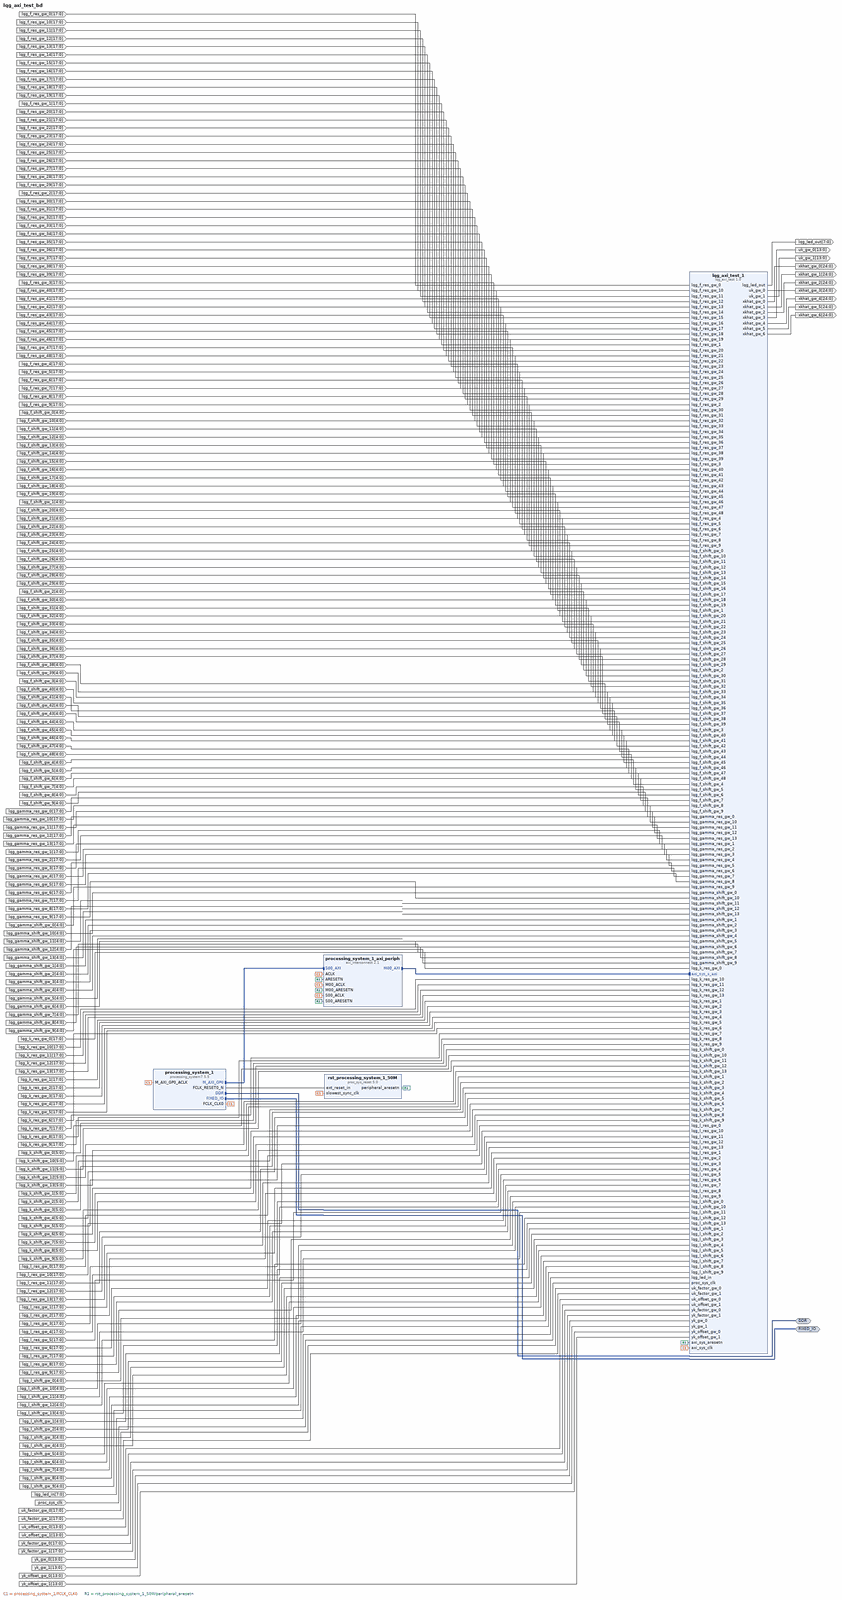
[diagram p0: block diagram of the top level, whole]
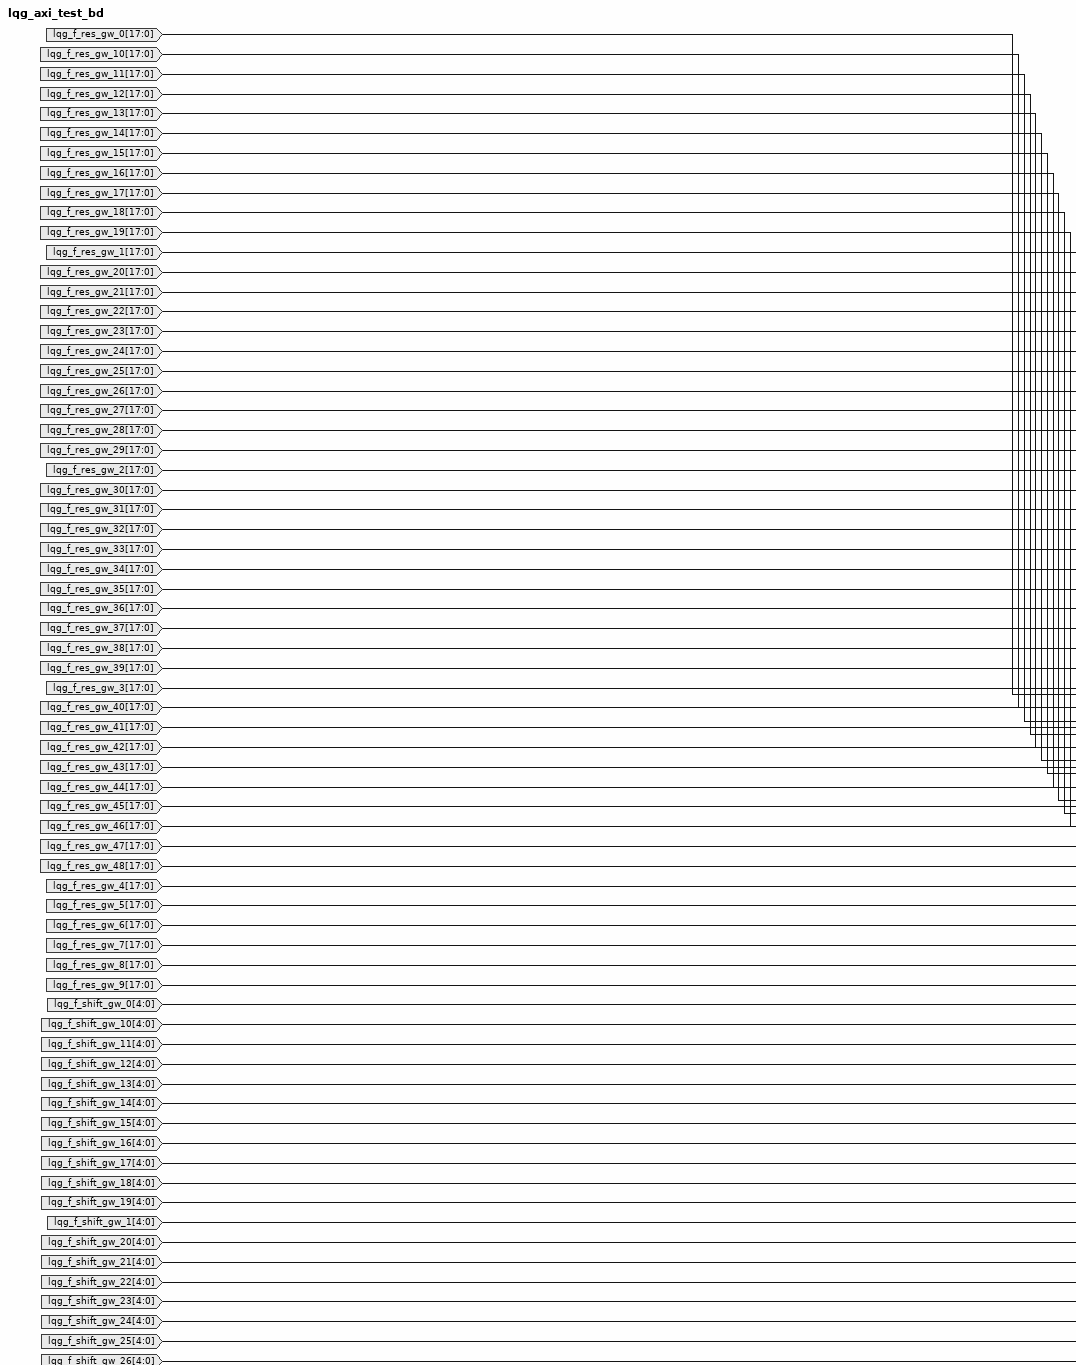
[diagram p1: block diagram of the top level, upper left part]
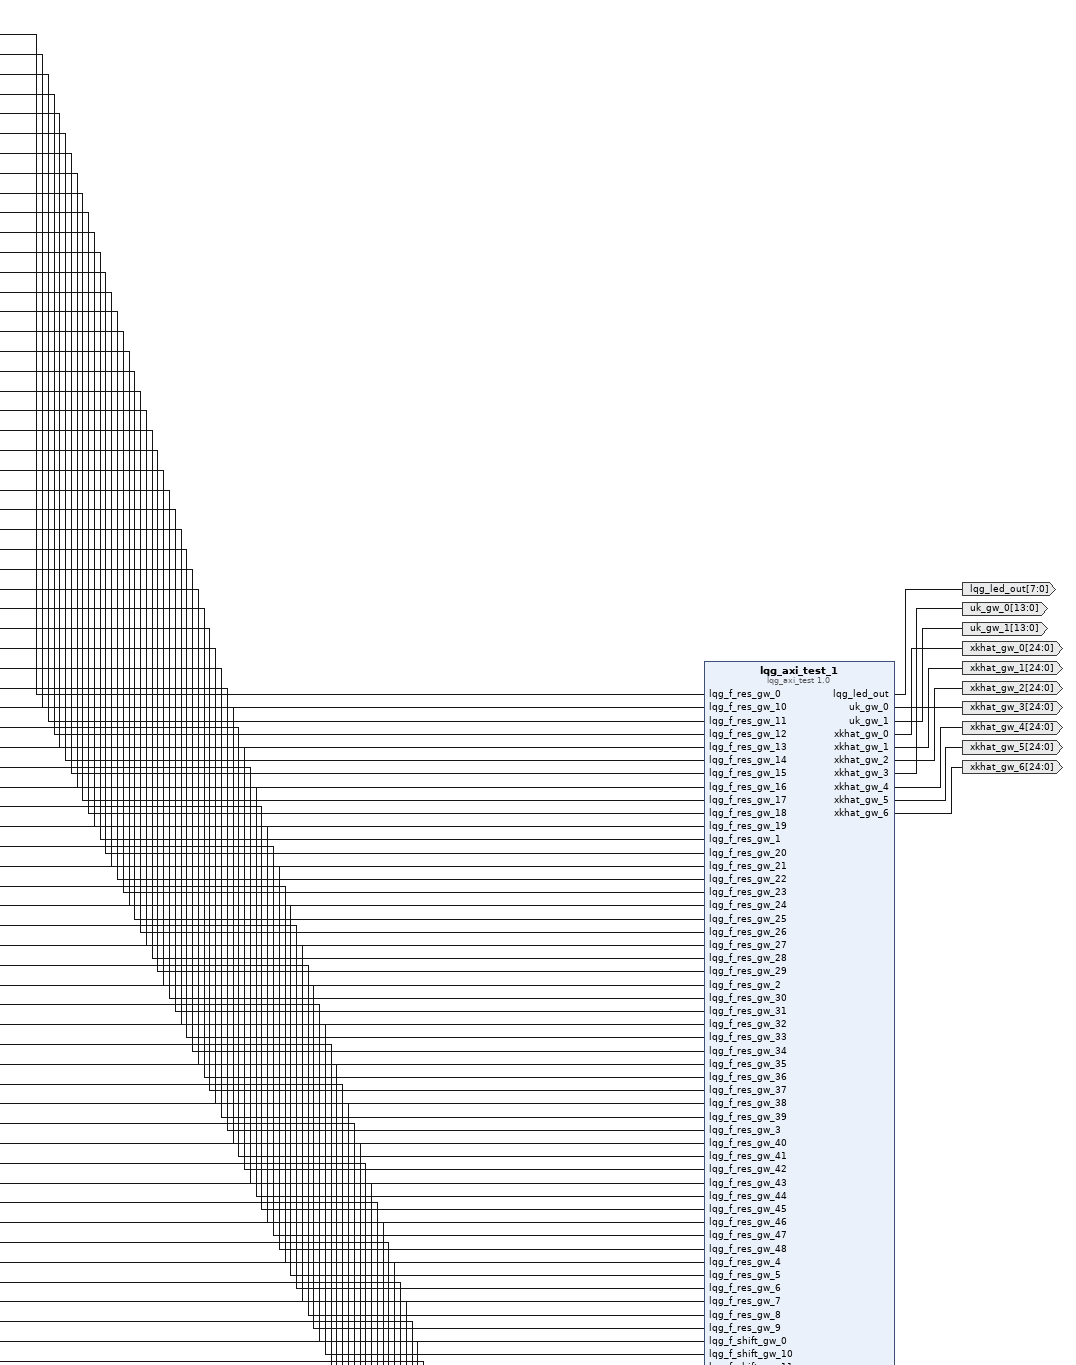
[diagram p2: block diagram of the top level, upper right part]
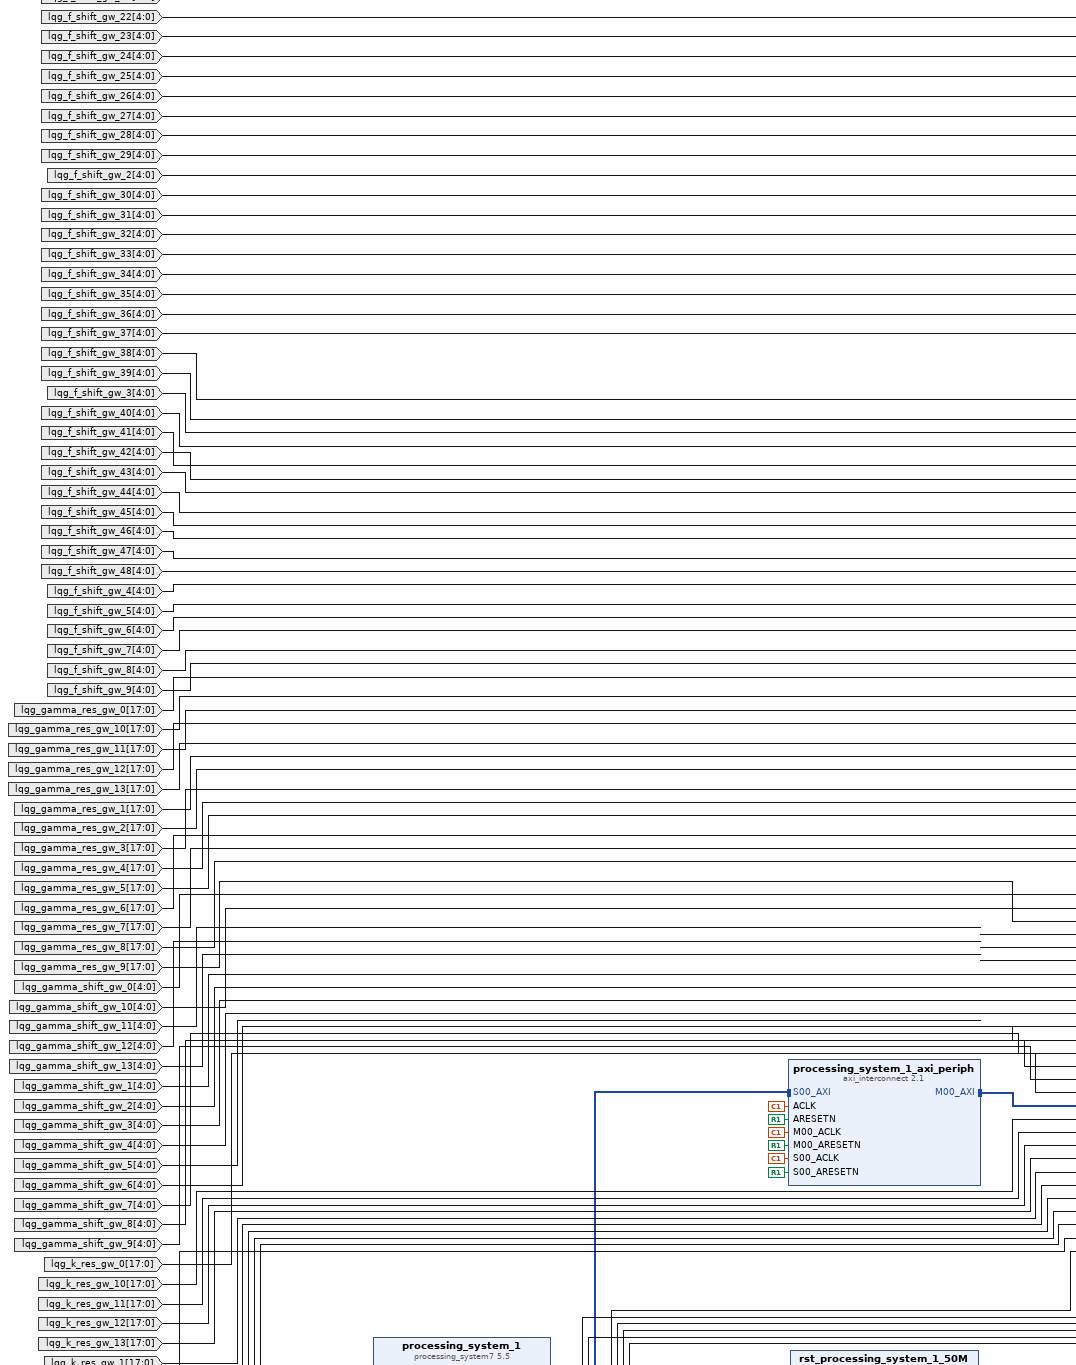
[diagram p3: block diagram of the top level, middle left part]
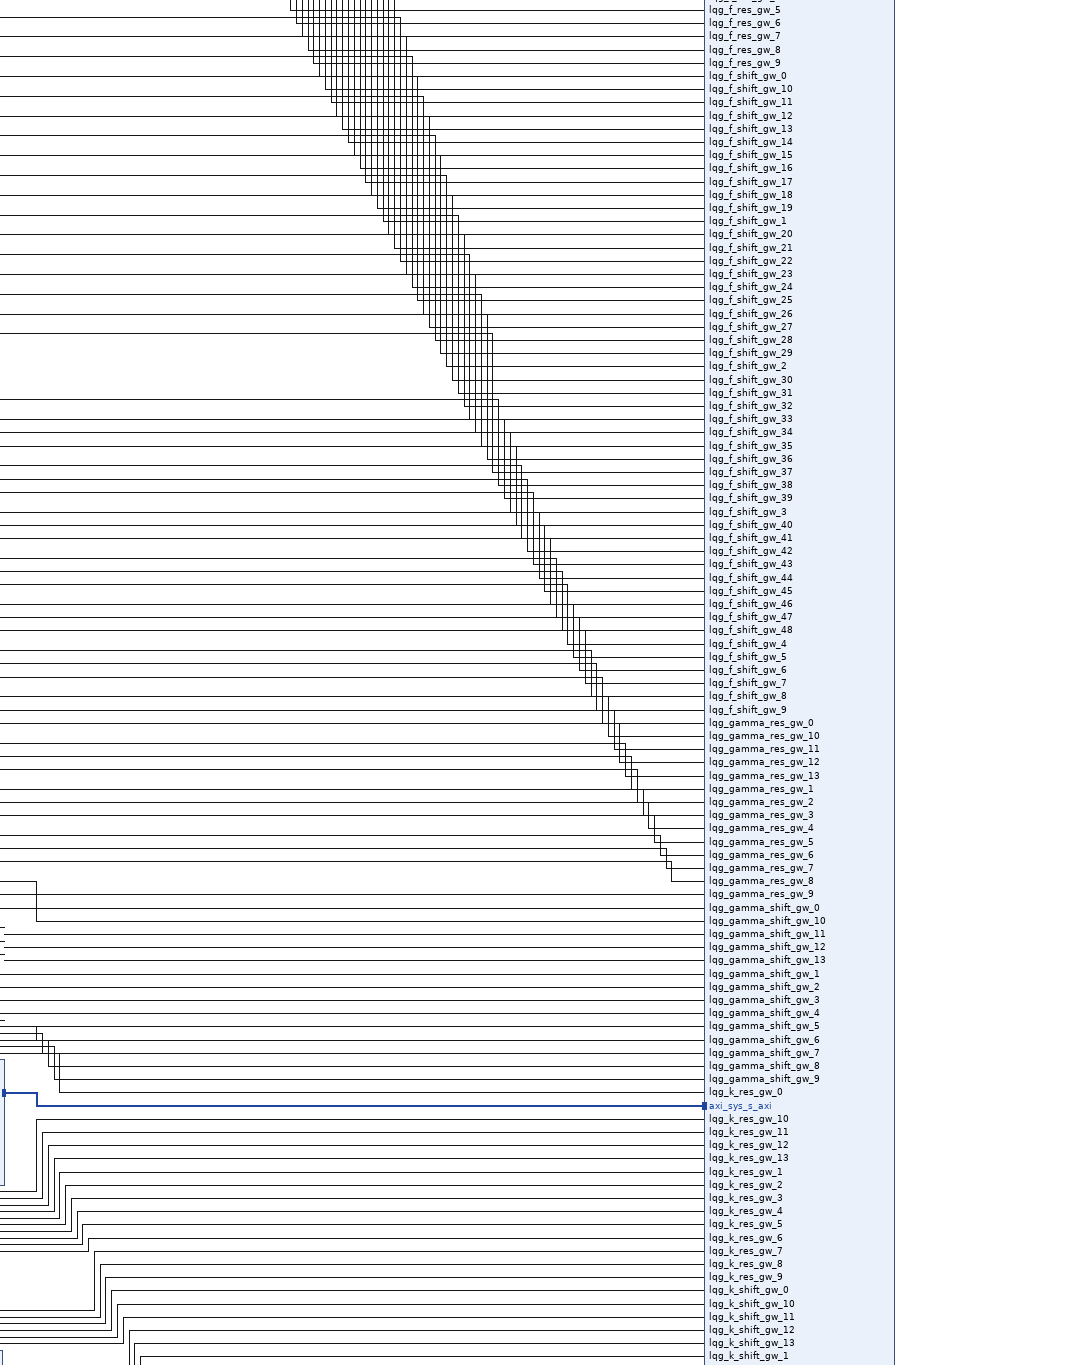
[diagram p4: block diagram of the top level, middle right part]
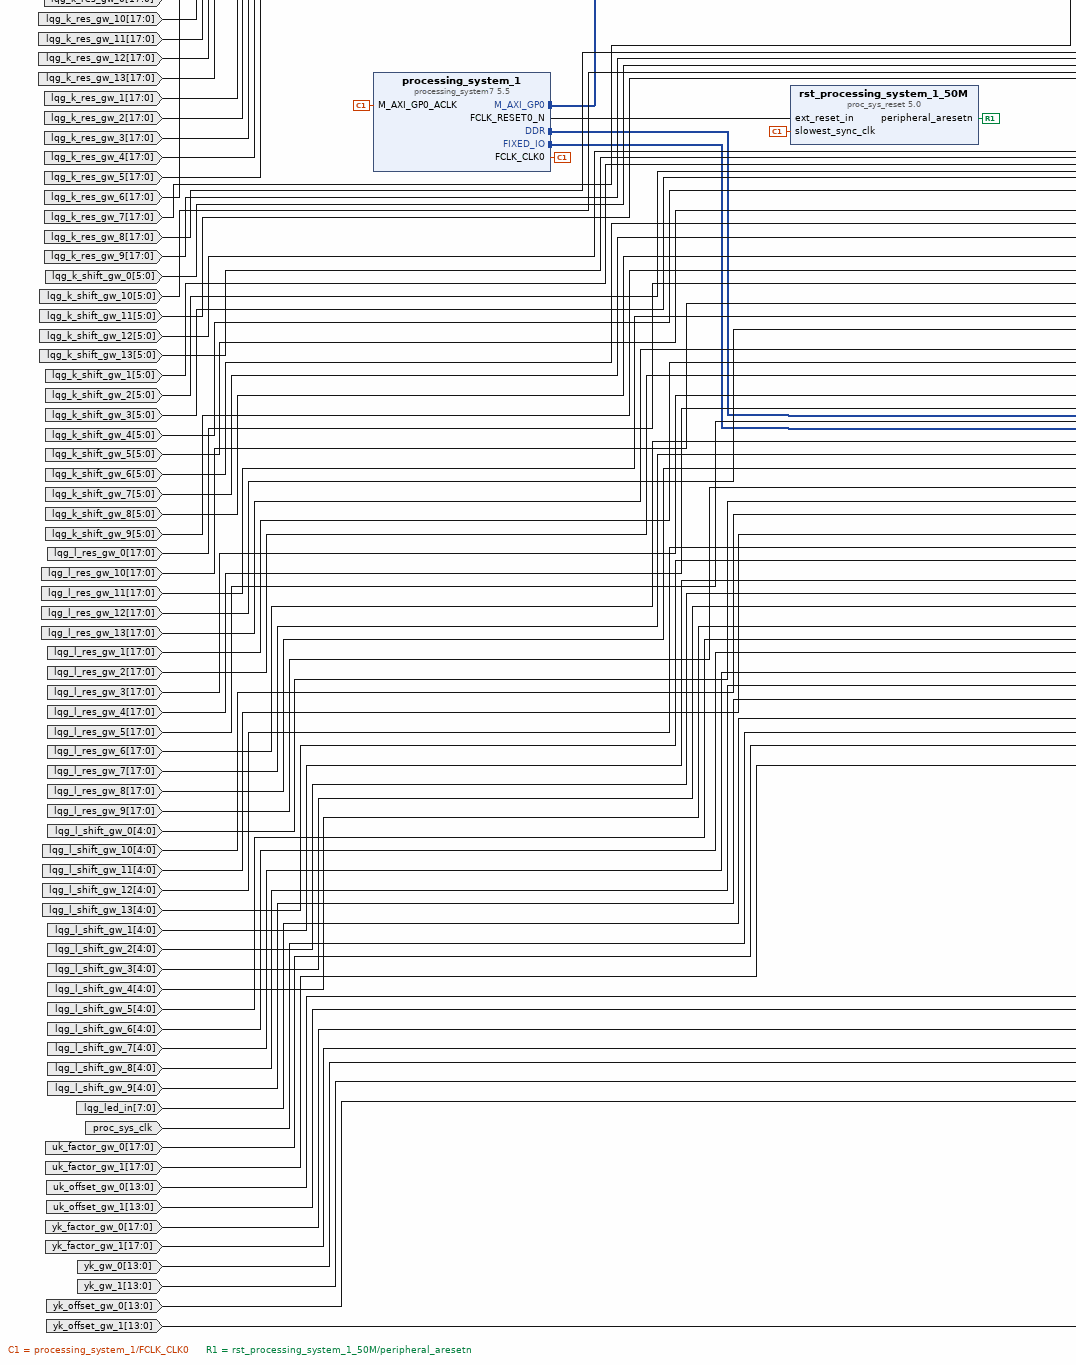
[diagram p5: block diagram of the top level, lower left part]
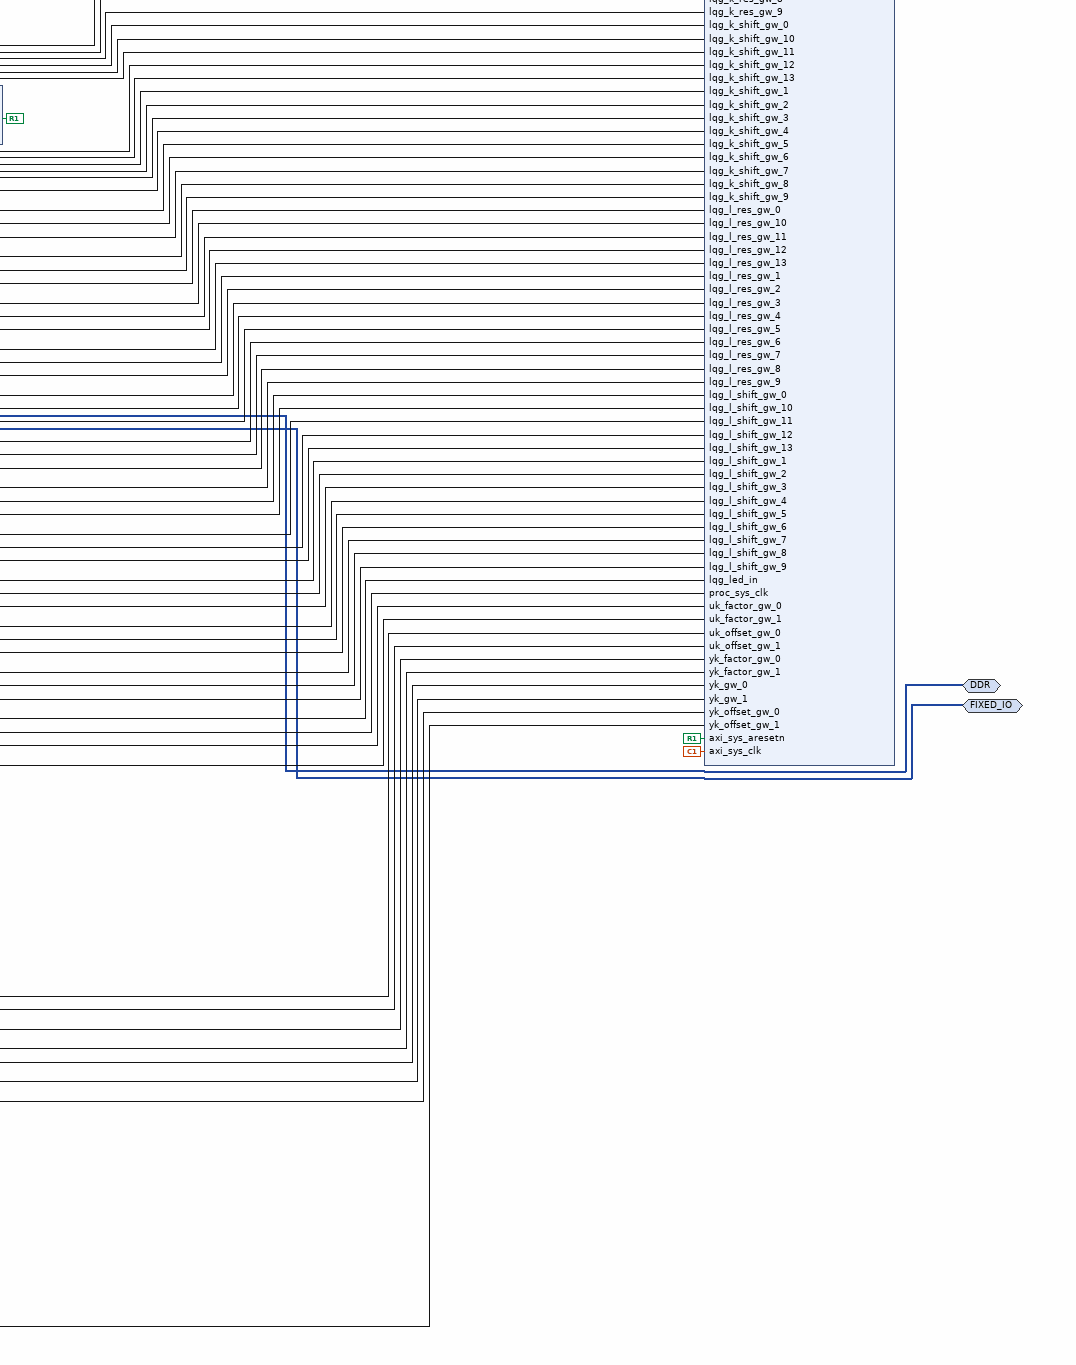
[diagram p6: block diagram of the top level, lower right part]
# Vivado block design lqg_axi_test_bd, xc7z020clg400-2, Vivado 2024.2
create_bd_design lqg_axi_test_bd

create_bd_intf_port -mode Master -vlnv xilinx.com:interface:ddrx_rtl:1.0 DDR
create_bd_intf_port -mode Master -vlnv xilinx.com:display_processing_system7:fixedio_rtl:1.0 FIXED_IO
create_bd_port -dir I -from 17 -to 0 -type data lqg_f_res_gw_0
create_bd_port -dir I -from 17 -to 0 -type data lqg_f_res_gw_1
create_bd_port -dir I -from 17 -to 0 -type data lqg_f_res_gw_10
create_bd_port -dir I -from 17 -to 0 -type data lqg_f_res_gw_11
create_bd_port -dir I -from 17 -to 0 -type data lqg_f_res_gw_12
create_bd_port -dir I -from 17 -to 0 -type data lqg_f_res_gw_13
create_bd_port -dir I -from 17 -to 0 -type data lqg_f_res_gw_14
create_bd_port -dir I -from 17 -to 0 -type data lqg_f_res_gw_15
create_bd_port -dir I -from 17 -to 0 -type data lqg_f_res_gw_16
create_bd_port -dir I -from 17 -to 0 -type data lqg_f_res_gw_17
create_bd_port -dir I -from 17 -to 0 -type data lqg_f_res_gw_18
create_bd_port -dir I -from 17 -to 0 -type data lqg_f_res_gw_19
create_bd_port -dir I -from 17 -to 0 -type data lqg_f_res_gw_2
create_bd_port -dir I -from 17 -to 0 -type data lqg_f_res_gw_20
create_bd_port -dir I -from 17 -to 0 -type data lqg_f_res_gw_21
create_bd_port -dir I -from 17 -to 0 -type data lqg_f_res_gw_22
create_bd_port -dir I -from 17 -to 0 -type data lqg_f_res_gw_23
create_bd_port -dir I -from 17 -to 0 -type data lqg_f_res_gw_24
create_bd_port -dir I -from 17 -to 0 -type data lqg_f_res_gw_25
create_bd_port -dir I -from 17 -to 0 -type data lqg_f_res_gw_26
create_bd_port -dir I -from 17 -to 0 -type data lqg_f_res_gw_27
create_bd_port -dir I -from 17 -to 0 -type data lqg_f_res_gw_28
create_bd_port -dir I -from 17 -to 0 -type data lqg_f_res_gw_29
create_bd_port -dir I -from 17 -to 0 -type data lqg_f_res_gw_3
create_bd_port -dir I -from 17 -to 0 -type data lqg_f_res_gw_30
create_bd_port -dir I -from 17 -to 0 -type data lqg_f_res_gw_31
create_bd_port -dir I -from 17 -to 0 -type data lqg_f_res_gw_32
create_bd_port -dir I -from 17 -to 0 -type data lqg_f_res_gw_33
create_bd_port -dir I -from 17 -to 0 -type data lqg_f_res_gw_34
create_bd_port -dir I -from 17 -to 0 -type data lqg_f_res_gw_35
create_bd_port -dir I -from 17 -to 0 -type data lqg_f_res_gw_36
create_bd_port -dir I -from 17 -to 0 -type data lqg_f_res_gw_37
create_bd_port -dir I -from 17 -to 0 -type data lqg_f_res_gw_38
create_bd_port -dir I -from 17 -to 0 -type data lqg_f_res_gw_39
create_bd_port -dir I -from 17 -to 0 -type data lqg_f_res_gw_4
create_bd_port -dir I -from 17 -to 0 -type data lqg_f_res_gw_40
create_bd_port -dir I -from 17 -to 0 -type data lqg_f_res_gw_41
create_bd_port -dir I -from 17 -to 0 -type data lqg_f_res_gw_42
create_bd_port -dir I -from 17 -to 0 -type data lqg_f_res_gw_43
create_bd_port -dir I -from 17 -to 0 -type data lqg_f_res_gw_44
create_bd_port -dir I -from 17 -to 0 -type data lqg_f_res_gw_45
create_bd_port -dir I -from 17 -to 0 -type data lqg_f_res_gw_46
create_bd_port -dir I -from 17 -to 0 -type data lqg_f_res_gw_47
create_bd_port -dir I -from 17 -to 0 -type data lqg_f_res_gw_48
create_bd_port -dir I -from 17 -to 0 -type data lqg_f_res_gw_5
create_bd_port -dir I -from 17 -to 0 -type data lqg_f_res_gw_6
create_bd_port -dir I -from 17 -to 0 -type data lqg_f_res_gw_7
create_bd_port -dir I -from 17 -to 0 -type data lqg_f_res_gw_8
create_bd_port -dir I -from 17 -to 0 -type data lqg_f_res_gw_9
create_bd_port -dir I -from 4 -to 0 -type data lqg_f_shift_gw_0
create_bd_port -dir I -from 4 -to 0 -type data lqg_f_shift_gw_1
create_bd_port -dir I -from 4 -to 0 -type data lqg_f_shift_gw_10
create_bd_port -dir I -from 4 -to 0 -type data lqg_f_shift_gw_11
create_bd_port -dir I -from 4 -to 0 -type data lqg_f_shift_gw_12
create_bd_port -dir I -from 4 -to 0 -type data lqg_f_shift_gw_13
create_bd_port -dir I -from 4 -to 0 -type data lqg_f_shift_gw_14
create_bd_port -dir I -from 4 -to 0 -type data lqg_f_shift_gw_15
create_bd_port -dir I -from 4 -to 0 -type data lqg_f_shift_gw_16
create_bd_port -dir I -from 4 -to 0 -type data lqg_f_shift_gw_17
create_bd_port -dir I -from 4 -to 0 -type data lqg_f_shift_gw_18
create_bd_port -dir I -from 4 -to 0 -type data lqg_f_shift_gw_19
create_bd_port -dir I -from 4 -to 0 -type data lqg_f_shift_gw_2
create_bd_port -dir I -from 4 -to 0 -type data lqg_f_shift_gw_20
create_bd_port -dir I -from 4 -to 0 -type data lqg_f_shift_gw_21
create_bd_port -dir I -from 4 -to 0 -type data lqg_f_shift_gw_22
create_bd_port -dir I -from 4 -to 0 -type data lqg_f_shift_gw_23
create_bd_port -dir I -from 4 -to 0 -type data lqg_f_shift_gw_24
create_bd_port -dir I -from 4 -to 0 -type data lqg_f_shift_gw_25
create_bd_port -dir I -from 4 -to 0 -type data lqg_f_shift_gw_26
create_bd_port -dir I -from 4 -to 0 -type data lqg_f_shift_gw_27
create_bd_port -dir I -from 4 -to 0 -type data lqg_f_shift_gw_28
create_bd_port -dir I -from 4 -to 0 -type data lqg_f_shift_gw_29
create_bd_port -dir I -from 4 -to 0 -type data lqg_f_shift_gw_3
create_bd_port -dir I -from 4 -to 0 -type data lqg_f_shift_gw_30
create_bd_port -dir I -from 4 -to 0 -type data lqg_f_shift_gw_31
create_bd_port -dir I -from 4 -to 0 -type data lqg_f_shift_gw_32
create_bd_port -dir I -from 4 -to 0 -type data lqg_f_shift_gw_33
create_bd_port -dir I -from 4 -to 0 -type data lqg_f_shift_gw_34
create_bd_port -dir I -from 4 -to 0 -type data lqg_f_shift_gw_35
create_bd_port -dir I -from 4 -to 0 -type data lqg_f_shift_gw_36
create_bd_port -dir I -from 4 -to 0 -type data lqg_f_shift_gw_37
create_bd_port -dir I -from 4 -to 0 -type data lqg_f_shift_gw_38
create_bd_port -dir I -from 4 -to 0 -type data lqg_f_shift_gw_39
create_bd_port -dir I -from 4 -to 0 -type data lqg_f_shift_gw_4
create_bd_port -dir I -from 4 -to 0 -type data lqg_f_shift_gw_40
create_bd_port -dir I -from 4 -to 0 -type data lqg_f_shift_gw_41
create_bd_port -dir I -from 4 -to 0 -type data lqg_f_shift_gw_42
create_bd_port -dir I -from 4 -to 0 -type data lqg_f_shift_gw_43
create_bd_port -dir I -from 4 -to 0 -type data lqg_f_shift_gw_44
create_bd_port -dir I -from 4 -to 0 -type data lqg_f_shift_gw_45
create_bd_port -dir I -from 4 -to 0 -type data lqg_f_shift_gw_46
create_bd_port -dir I -from 4 -to 0 -type data lqg_f_shift_gw_47
create_bd_port -dir I -from 4 -to 0 -type data lqg_f_shift_gw_48
create_bd_port -dir I -from 4 -to 0 -type data lqg_f_shift_gw_5
create_bd_port -dir I -from 4 -to 0 -type data lqg_f_shift_gw_6
create_bd_port -dir I -from 4 -to 0 -type data lqg_f_shift_gw_7
create_bd_port -dir I -from 4 -to 0 -type data lqg_f_shift_gw_8
create_bd_port -dir I -from 4 -to 0 -type data lqg_f_shift_gw_9
create_bd_port -dir I -from 17 -to 0 -type data lqg_gamma_res_gw_0
create_bd_port -dir I -from 17 -to 0 -type data lqg_gamma_res_gw_1
create_bd_port -dir I -from 17 -to 0 -type data lqg_gamma_res_gw_10
create_bd_port -dir I -from 17 -to 0 -type data lqg_gamma_res_gw_11
create_bd_port -dir I -from 17 -to 0 -type data lqg_gamma_res_gw_12
create_bd_port -dir I -from 17 -to 0 -type data lqg_gamma_res_gw_13
create_bd_port -dir I -from 17 -to 0 -type data lqg_gamma_res_gw_2
create_bd_port -dir I -from 17 -to 0 -type data lqg_gamma_res_gw_3
create_bd_port -dir I -from 17 -to 0 -type data lqg_gamma_res_gw_4
create_bd_port -dir I -from 17 -to 0 -type data lqg_gamma_res_gw_5
create_bd_port -dir I -from 17 -to 0 -type data lqg_gamma_res_gw_6
create_bd_port -dir I -from 17 -to 0 -type data lqg_gamma_res_gw_7
create_bd_port -dir I -from 17 -to 0 -type data lqg_gamma_res_gw_8
create_bd_port -dir I -from 17 -to 0 -type data lqg_gamma_res_gw_9
create_bd_port -dir I -from 4 -to 0 -type data lqg_gamma_shift_gw_0
create_bd_port -dir I -from 4 -to 0 -type data lqg_gamma_shift_gw_1
create_bd_port -dir I -from 4 -to 0 -type data lqg_gamma_shift_gw_10
create_bd_port -dir I -from 4 -to 0 -type data lqg_gamma_shift_gw_11
create_bd_port -dir I -from 4 -to 0 -type data lqg_gamma_shift_gw_12
create_bd_port -dir I -from 4 -to 0 -type data lqg_gamma_shift_gw_13
create_bd_port -dir I -from 4 -to 0 -type data lqg_gamma_shift_gw_2
create_bd_port -dir I -from 4 -to 0 -type data lqg_gamma_shift_gw_3
create_bd_port -dir I -from 4 -to 0 -type data lqg_gamma_shift_gw_4
create_bd_port -dir I -from 4 -to 0 -type data lqg_gamma_shift_gw_5
create_bd_port -dir I -from 4 -to 0 -type data lqg_gamma_shift_gw_6
create_bd_port -dir I -from 4 -to 0 -type data lqg_gamma_shift_gw_7
create_bd_port -dir I -from 4 -to 0 -type data lqg_gamma_shift_gw_8
create_bd_port -dir I -from 4 -to 0 -type data lqg_gamma_shift_gw_9
create_bd_port -dir I -from 17 -to 0 -type data lqg_k_res_gw_0
create_bd_port -dir I -from 17 -to 0 -type data lqg_k_res_gw_1
create_bd_port -dir I -from 17 -to 0 -type data lqg_k_res_gw_10
create_bd_port -dir I -from 17 -to 0 -type data lqg_k_res_gw_11
create_bd_port -dir I -from 17 -to 0 -type data lqg_k_res_gw_12
create_bd_port -dir I -from 17 -to 0 -type data lqg_k_res_gw_13
create_bd_port -dir I -from 17 -to 0 -type data lqg_k_res_gw_2
create_bd_port -dir I -from 17 -to 0 -type data lqg_k_res_gw_3
create_bd_port -dir I -from 17 -to 0 -type data lqg_k_res_gw_4
create_bd_port -dir I -from 17 -to 0 -type data lqg_k_res_gw_5
create_bd_port -dir I -from 17 -to 0 -type data lqg_k_res_gw_6
create_bd_port -dir I -from 17 -to 0 -type data lqg_k_res_gw_7
create_bd_port -dir I -from 17 -to 0 -type data lqg_k_res_gw_8
create_bd_port -dir I -from 17 -to 0 -type data lqg_k_res_gw_9
create_bd_port -dir I -from 5 -to 0 -type data lqg_k_shift_gw_0
create_bd_port -dir I -from 5 -to 0 -type data lqg_k_shift_gw_1
create_bd_port -dir I -from 5 -to 0 -type data lqg_k_shift_gw_10
create_bd_port -dir I -from 5 -to 0 -type data lqg_k_shift_gw_11
create_bd_port -dir I -from 5 -to 0 -type data lqg_k_shift_gw_12
create_bd_port -dir I -from 5 -to 0 -type data lqg_k_shift_gw_13
create_bd_port -dir I -from 5 -to 0 -type data lqg_k_shift_gw_2
create_bd_port -dir I -from 5 -to 0 -type data lqg_k_shift_gw_3
create_bd_port -dir I -from 5 -to 0 -type data lqg_k_shift_gw_4
create_bd_port -dir I -from 5 -to 0 -type data lqg_k_shift_gw_5
create_bd_port -dir I -from 5 -to 0 -type data lqg_k_shift_gw_6
create_bd_port -dir I -from 5 -to 0 -type data lqg_k_shift_gw_7
create_bd_port -dir I -from 5 -to 0 -type data lqg_k_shift_gw_8
create_bd_port -dir I -from 5 -to 0 -type data lqg_k_shift_gw_9
create_bd_port -dir I -from 17 -to 0 -type data lqg_l_res_gw_0
create_bd_port -dir I -from 17 -to 0 -type data lqg_l_res_gw_1
create_bd_port -dir I -from 17 -to 0 -type data lqg_l_res_gw_10
create_bd_port -dir I -from 17 -to 0 -type data lqg_l_res_gw_11
create_bd_port -dir I -from 17 -to 0 -type data lqg_l_res_gw_12
create_bd_port -dir I -from 17 -to 0 -type data lqg_l_res_gw_13
create_bd_port -dir I -from 17 -to 0 -type data lqg_l_res_gw_2
create_bd_port -dir I -from 17 -to 0 -type data lqg_l_res_gw_3
create_bd_port -dir I -from 17 -to 0 -type data lqg_l_res_gw_4
create_bd_port -dir I -from 17 -to 0 -type data lqg_l_res_gw_5
create_bd_port -dir I -from 17 -to 0 -type data lqg_l_res_gw_6
create_bd_port -dir I -from 17 -to 0 -type data lqg_l_res_gw_7
create_bd_port -dir I -from 17 -to 0 -type data lqg_l_res_gw_8
create_bd_port -dir I -from 17 -to 0 -type data lqg_l_res_gw_9
create_bd_port -dir I -from 4 -to 0 -type data lqg_l_shift_gw_0
create_bd_port -dir I -from 4 -to 0 -type data lqg_l_shift_gw_1
create_bd_port -dir I -from 4 -to 0 -type data lqg_l_shift_gw_10
create_bd_port -dir I -from 4 -to 0 -type data lqg_l_shift_gw_11
create_bd_port -dir I -from 4 -to 0 -type data lqg_l_shift_gw_12
create_bd_port -dir I -from 4 -to 0 -type data lqg_l_shift_gw_13
create_bd_port -dir I -from 4 -to 0 -type data lqg_l_shift_gw_2
create_bd_port -dir I -from 4 -to 0 -type data lqg_l_shift_gw_3
create_bd_port -dir I -from 4 -to 0 -type data lqg_l_shift_gw_4
create_bd_port -dir I -from 4 -to 0 -type data lqg_l_shift_gw_5
create_bd_port -dir I -from 4 -to 0 -type data lqg_l_shift_gw_6
create_bd_port -dir I -from 4 -to 0 -type data lqg_l_shift_gw_7
create_bd_port -dir I -from 4 -to 0 -type data lqg_l_shift_gw_8
create_bd_port -dir I -from 4 -to 0 -type data lqg_l_shift_gw_9
create_bd_port -dir I -from 7 -to 0 -type data lqg_led_in
create_bd_port -dir O -from 7 -to 0 -type data lqg_led_out
create_bd_port -dir I -type clk proc_sys_clk
create_bd_port -dir I -from 17 -to 0 -type data uk_factor_gw_0
create_bd_port -dir I -from 17 -to 0 -type data uk_factor_gw_1
create_bd_port -dir O -from 13 -to 0 -type data uk_gw_0
create_bd_port -dir O -from 13 -to 0 -type data uk_gw_1
create_bd_port -dir I -from 13 -to 0 -type data uk_offset_gw_0
create_bd_port -dir I -from 13 -to 0 -type data uk_offset_gw_1
create_bd_port -dir O -from 24 -to 0 -type data xkhat_gw_0
create_bd_port -dir O -from 24 -to 0 -type data xkhat_gw_1
create_bd_port -dir O -from 24 -to 0 -type data xkhat_gw_2
create_bd_port -dir O -from 24 -to 0 -type data xkhat_gw_3
create_bd_port -dir O -from 24 -to 0 -type data xkhat_gw_4
create_bd_port -dir O -from 24 -to 0 -type data xkhat_gw_5
create_bd_port -dir O -from 24 -to 0 -type data xkhat_gw_6
create_bd_port -dir I -from 17 -to 0 -type data yk_factor_gw_0
create_bd_port -dir I -from 17 -to 0 -type data yk_factor_gw_1
create_bd_port -dir I -from 13 -to 0 -type data yk_gw_0
create_bd_port -dir I -from 13 -to 0 -type data yk_gw_1
create_bd_port -dir I -from 13 -to 0 -type data yk_offset_gw_0
create_bd_port -dir I -from 13 -to 0 -type data yk_offset_gw_1

create_bd_cell -type ip -vlnv acin:vmc:lqg_axi_test:1.0 lqg_axi_test_1
create_bd_cell -type ip -vlnv xilinx.com:ip:processing_system7:5.5 processing_system_1
# 33 more settings of processing_system_1 are not shown: defaults, MIO pin electricals, DDR timing, and values the tool derives
create_bd_cell -type ip -vlnv xilinx.com:ip:axi_interconnect:2.1 processing_system_1_axi_periph
set_property -dict {CONFIG.NUM_MI 1} [get_bd_cells processing_system_1_axi_periph]
create_bd_cell -type ip -vlnv xilinx.com:ip:proc_sys_reset:5.0 rst_processing_system_1_50M

# ---- connections ----

connect_bd_intf_net [get_bd_intf_ports DDR] [get_bd_intf_pins processing_system_1/DDR]
connect_bd_intf_net [get_bd_intf_ports FIXED_IO] [get_bd_intf_pins processing_system_1/FIXED_IO]
connect_bd_intf_net [get_bd_intf_pins processing_system_1/M_AXI_GP0] [get_bd_intf_pins processing_system_1_axi_periph/S00_AXI]
connect_bd_intf_net [get_bd_intf_pins processing_system_1_axi_periph/M00_AXI] [get_bd_intf_pins lqg_axi_test_1/axi_sys_s_axi]
connect_bd_net [get_bd_pins lqg_axi_test_1/lqg_led_out] [get_bd_ports lqg_led_out]
connect_bd_net [get_bd_pins lqg_axi_test_1/uk_gw_0] [get_bd_ports uk_gw_0]
connect_bd_net [get_bd_pins lqg_axi_test_1/uk_gw_1] [get_bd_ports uk_gw_1]
connect_bd_net [get_bd_pins lqg_axi_test_1/xkhat_gw_0] [get_bd_ports xkhat_gw_0]
connect_bd_net [get_bd_pins lqg_axi_test_1/xkhat_gw_1] [get_bd_ports xkhat_gw_1]
connect_bd_net [get_bd_pins lqg_axi_test_1/xkhat_gw_2] [get_bd_ports xkhat_gw_2]
connect_bd_net [get_bd_pins lqg_axi_test_1/xkhat_gw_3] [get_bd_ports xkhat_gw_3]
connect_bd_net [get_bd_pins lqg_axi_test_1/xkhat_gw_4] [get_bd_ports xkhat_gw_4]
connect_bd_net [get_bd_pins lqg_axi_test_1/xkhat_gw_5] [get_bd_ports xkhat_gw_5]
connect_bd_net [get_bd_pins lqg_axi_test_1/xkhat_gw_6] [get_bd_ports xkhat_gw_6]
connect_bd_net -net lqg_f_res_gw_0_1 [get_bd_ports lqg_f_res_gw_0] [get_bd_pins lqg_axi_test_1/lqg_f_res_gw_0]
connect_bd_net -net lqg_f_res_gw_10_1 [get_bd_ports lqg_f_res_gw_10] [get_bd_pins lqg_axi_test_1/lqg_f_res_gw_10]
connect_bd_net -net lqg_f_res_gw_11_1 [get_bd_ports lqg_f_res_gw_11] [get_bd_pins lqg_axi_test_1/lqg_f_res_gw_11]
connect_bd_net -net lqg_f_res_gw_12_1 [get_bd_ports lqg_f_res_gw_12] [get_bd_pins lqg_axi_test_1/lqg_f_res_gw_12]
connect_bd_net -net lqg_f_res_gw_13_1 [get_bd_ports lqg_f_res_gw_13] [get_bd_pins lqg_axi_test_1/lqg_f_res_gw_13]
connect_bd_net -net lqg_f_res_gw_14_1 [get_bd_ports lqg_f_res_gw_14] [get_bd_pins lqg_axi_test_1/lqg_f_res_gw_14]
connect_bd_net -net lqg_f_res_gw_15_1 [get_bd_ports lqg_f_res_gw_15] [get_bd_pins lqg_axi_test_1/lqg_f_res_gw_15]
connect_bd_net -net lqg_f_res_gw_16_1 [get_bd_ports lqg_f_res_gw_16] [get_bd_pins lqg_axi_test_1/lqg_f_res_gw_16]
connect_bd_net -net lqg_f_res_gw_17_1 [get_bd_ports lqg_f_res_gw_17] [get_bd_pins lqg_axi_test_1/lqg_f_res_gw_17]
connect_bd_net -net lqg_f_res_gw_18_1 [get_bd_ports lqg_f_res_gw_18] [get_bd_pins lqg_axi_test_1/lqg_f_res_gw_18]
connect_bd_net -net lqg_f_res_gw_19_1 [get_bd_ports lqg_f_res_gw_19] [get_bd_pins lqg_axi_test_1/lqg_f_res_gw_19]
connect_bd_net -net lqg_f_res_gw_1_1 [get_bd_ports lqg_f_res_gw_1] [get_bd_pins lqg_axi_test_1/lqg_f_res_gw_1]
connect_bd_net -net lqg_f_res_gw_20_1 [get_bd_ports lqg_f_res_gw_20] [get_bd_pins lqg_axi_test_1/lqg_f_res_gw_20]
connect_bd_net -net lqg_f_res_gw_21_1 [get_bd_ports lqg_f_res_gw_21] [get_bd_pins lqg_axi_test_1/lqg_f_res_gw_21]
connect_bd_net -net lqg_f_res_gw_22_1 [get_bd_ports lqg_f_res_gw_22] [get_bd_pins lqg_axi_test_1/lqg_f_res_gw_22]
connect_bd_net -net lqg_f_res_gw_23_1 [get_bd_ports lqg_f_res_gw_23] [get_bd_pins lqg_axi_test_1/lqg_f_res_gw_23]
connect_bd_net -net lqg_f_res_gw_24_1 [get_bd_ports lqg_f_res_gw_24] [get_bd_pins lqg_axi_test_1/lqg_f_res_gw_24]
connect_bd_net -net lqg_f_res_gw_25_1 [get_bd_ports lqg_f_res_gw_25] [get_bd_pins lqg_axi_test_1/lqg_f_res_gw_25]
connect_bd_net -net lqg_f_res_gw_26_1 [get_bd_ports lqg_f_res_gw_26] [get_bd_pins lqg_axi_test_1/lqg_f_res_gw_26]
connect_bd_net -net lqg_f_res_gw_27_1 [get_bd_ports lqg_f_res_gw_27] [get_bd_pins lqg_axi_test_1/lqg_f_res_gw_27]
connect_bd_net -net lqg_f_res_gw_28_1 [get_bd_ports lqg_f_res_gw_28] [get_bd_pins lqg_axi_test_1/lqg_f_res_gw_28]
connect_bd_net -net lqg_f_res_gw_29_1 [get_bd_ports lqg_f_res_gw_29] [get_bd_pins lqg_axi_test_1/lqg_f_res_gw_29]
connect_bd_net -net lqg_f_res_gw_2_1 [get_bd_ports lqg_f_res_gw_2] [get_bd_pins lqg_axi_test_1/lqg_f_res_gw_2]
connect_bd_net -net lqg_f_res_gw_30_1 [get_bd_ports lqg_f_res_gw_30] [get_bd_pins lqg_axi_test_1/lqg_f_res_gw_30]
connect_bd_net -net lqg_f_res_gw_31_1 [get_bd_ports lqg_f_res_gw_31] [get_bd_pins lqg_axi_test_1/lqg_f_res_gw_31]
connect_bd_net -net lqg_f_res_gw_32_1 [get_bd_ports lqg_f_res_gw_32] [get_bd_pins lqg_axi_test_1/lqg_f_res_gw_32]
connect_bd_net -net lqg_f_res_gw_33_1 [get_bd_ports lqg_f_res_gw_33] [get_bd_pins lqg_axi_test_1/lqg_f_res_gw_33]
connect_bd_net -net lqg_f_res_gw_34_1 [get_bd_ports lqg_f_res_gw_34] [get_bd_pins lqg_axi_test_1/lqg_f_res_gw_34]
connect_bd_net -net lqg_f_res_gw_35_1 [get_bd_ports lqg_f_res_gw_35] [get_bd_pins lqg_axi_test_1/lqg_f_res_gw_35]
connect_bd_net -net lqg_f_res_gw_36_1 [get_bd_ports lqg_f_res_gw_36] [get_bd_pins lqg_axi_test_1/lqg_f_res_gw_36]
connect_bd_net -net lqg_f_res_gw_37_1 [get_bd_ports lqg_f_res_gw_37] [get_bd_pins lqg_axi_test_1/lqg_f_res_gw_37]
connect_bd_net -net lqg_f_res_gw_38_1 [get_bd_ports lqg_f_res_gw_38] [get_bd_pins lqg_axi_test_1/lqg_f_res_gw_38]
connect_bd_net -net lqg_f_res_gw_39_1 [get_bd_ports lqg_f_res_gw_39] [get_bd_pins lqg_axi_test_1/lqg_f_res_gw_39]
connect_bd_net -net lqg_f_res_gw_3_1 [get_bd_ports lqg_f_res_gw_3] [get_bd_pins lqg_axi_test_1/lqg_f_res_gw_3]
connect_bd_net -net lqg_f_res_gw_40_1 [get_bd_ports lqg_f_res_gw_40] [get_bd_pins lqg_axi_test_1/lqg_f_res_gw_40]
connect_bd_net -net lqg_f_res_gw_41_1 [get_bd_ports lqg_f_res_gw_41] [get_bd_pins lqg_axi_test_1/lqg_f_res_gw_41]
connect_bd_net -net lqg_f_res_gw_42_1 [get_bd_ports lqg_f_res_gw_42] [get_bd_pins lqg_axi_test_1/lqg_f_res_gw_42]
connect_bd_net -net lqg_f_res_gw_43_1 [get_bd_ports lqg_f_res_gw_43] [get_bd_pins lqg_axi_test_1/lqg_f_res_gw_43]
connect_bd_net -net lqg_f_res_gw_44_1 [get_bd_ports lqg_f_res_gw_44] [get_bd_pins lqg_axi_test_1/lqg_f_res_gw_44]
connect_bd_net -net lqg_f_res_gw_45_1 [get_bd_ports lqg_f_res_gw_45] [get_bd_pins lqg_axi_test_1/lqg_f_res_gw_45]
connect_bd_net -net lqg_f_res_gw_46_1 [get_bd_ports lqg_f_res_gw_46] [get_bd_pins lqg_axi_test_1/lqg_f_res_gw_46]
connect_bd_net -net lqg_f_res_gw_47_1 [get_bd_ports lqg_f_res_gw_47] [get_bd_pins lqg_axi_test_1/lqg_f_res_gw_47]
connect_bd_net -net lqg_f_res_gw_48_1 [get_bd_ports lqg_f_res_gw_48] [get_bd_pins lqg_axi_test_1/lqg_f_res_gw_48]
connect_bd_net -net lqg_f_res_gw_4_1 [get_bd_ports lqg_f_res_gw_4] [get_bd_pins lqg_axi_test_1/lqg_f_res_gw_4]
connect_bd_net -net lqg_f_res_gw_5_1 [get_bd_ports lqg_f_res_gw_5] [get_bd_pins lqg_axi_test_1/lqg_f_res_gw_5]
connect_bd_net -net lqg_f_res_gw_6_1 [get_bd_ports lqg_f_res_gw_6] [get_bd_pins lqg_axi_test_1/lqg_f_res_gw_6]
connect_bd_net -net lqg_f_res_gw_7_1 [get_bd_ports lqg_f_res_gw_7] [get_bd_pins lqg_axi_test_1/lqg_f_res_gw_7]
connect_bd_net -net lqg_f_res_gw_8_1 [get_bd_ports lqg_f_res_gw_8] [get_bd_pins lqg_axi_test_1/lqg_f_res_gw_8]
connect_bd_net -net lqg_f_res_gw_9_1 [get_bd_ports lqg_f_res_gw_9] [get_bd_pins lqg_axi_test_1/lqg_f_res_gw_9]
connect_bd_net -net lqg_f_shift_gw_0_1 [get_bd_ports lqg_f_shift_gw_0] [get_bd_pins lqg_axi_test_1/lqg_f_shift_gw_0]
connect_bd_net -net lqg_f_shift_gw_10_1 [get_bd_ports lqg_f_shift_gw_10] [get_bd_pins lqg_axi_test_1/lqg_f_shift_gw_10]
connect_bd_net -net lqg_f_shift_gw_11_1 [get_bd_ports lqg_f_shift_gw_11] [get_bd_pins lqg_axi_test_1/lqg_f_shift_gw_11]
connect_bd_net -net lqg_f_shift_gw_12_1 [get_bd_ports lqg_f_shift_gw_12] [get_bd_pins lqg_axi_test_1/lqg_f_shift_gw_12]
connect_bd_net -net lqg_f_shift_gw_13_1 [get_bd_ports lqg_f_shift_gw_13] [get_bd_pins lqg_axi_test_1/lqg_f_shift_gw_13]
connect_bd_net -net lqg_f_shift_gw_14_1 [get_bd_ports lqg_f_shift_gw_14] [get_bd_pins lqg_axi_test_1/lqg_f_shift_gw_14]
connect_bd_net -net lqg_f_shift_gw_15_1 [get_bd_ports lqg_f_shift_gw_15] [get_bd_pins lqg_axi_test_1/lqg_f_shift_gw_15]
connect_bd_net -net lqg_f_shift_gw_16_1 [get_bd_ports lqg_f_shift_gw_16] [get_bd_pins lqg_axi_test_1/lqg_f_shift_gw_16]
connect_bd_net -net lqg_f_shift_gw_17_1 [get_bd_ports lqg_f_shift_gw_17] [get_bd_pins lqg_axi_test_1/lqg_f_shift_gw_17]
connect_bd_net -net lqg_f_shift_gw_18_1 [get_bd_ports lqg_f_shift_gw_18] [get_bd_pins lqg_axi_test_1/lqg_f_shift_gw_18]
connect_bd_net -net lqg_f_shift_gw_19_1 [get_bd_ports lqg_f_shift_gw_19] [get_bd_pins lqg_axi_test_1/lqg_f_shift_gw_19]
connect_bd_net -net lqg_f_shift_gw_1_1 [get_bd_ports lqg_f_shift_gw_1] [get_bd_pins lqg_axi_test_1/lqg_f_shift_gw_1]
connect_bd_net -net lqg_f_shift_gw_20_1 [get_bd_ports lqg_f_shift_gw_20] [get_bd_pins lqg_axi_test_1/lqg_f_shift_gw_20]
connect_bd_net -net lqg_f_shift_gw_21_1 [get_bd_ports lqg_f_shift_gw_21] [get_bd_pins lqg_axi_test_1/lqg_f_shift_gw_21]
connect_bd_net -net lqg_f_shift_gw_22_1 [get_bd_ports lqg_f_shift_gw_22] [get_bd_pins lqg_axi_test_1/lqg_f_shift_gw_22]
connect_bd_net -net lqg_f_shift_gw_23_1 [get_bd_ports lqg_f_shift_gw_23] [get_bd_pins lqg_axi_test_1/lqg_f_shift_gw_23]
connect_bd_net -net lqg_f_shift_gw_24_1 [get_bd_ports lqg_f_shift_gw_24] [get_bd_pins lqg_axi_test_1/lqg_f_shift_gw_24]
connect_bd_net -net lqg_f_shift_gw_25_1 [get_bd_ports lqg_f_shift_gw_25] [get_bd_pins lqg_axi_test_1/lqg_f_shift_gw_25]
connect_bd_net -net lqg_f_shift_gw_26_1 [get_bd_ports lqg_f_shift_gw_26] [get_bd_pins lqg_axi_test_1/lqg_f_shift_gw_26]
connect_bd_net -net lqg_f_shift_gw_27_1 [get_bd_ports lqg_f_shift_gw_27] [get_bd_pins lqg_axi_test_1/lqg_f_shift_gw_27]
connect_bd_net -net lqg_f_shift_gw_28_1 [get_bd_ports lqg_f_shift_gw_28] [get_bd_pins lqg_axi_test_1/lqg_f_shift_gw_28]
connect_bd_net -net lqg_f_shift_gw_29_1 [get_bd_ports lqg_f_shift_gw_29] [get_bd_pins lqg_axi_test_1/lqg_f_shift_gw_29]
connect_bd_net -net lqg_f_shift_gw_2_1 [get_bd_ports lqg_f_shift_gw_2] [get_bd_pins lqg_axi_test_1/lqg_f_shift_gw_2]
connect_bd_net -net lqg_f_shift_gw_30_1 [get_bd_ports lqg_f_shift_gw_30] [get_bd_pins lqg_axi_test_1/lqg_f_shift_gw_30]
connect_bd_net -net lqg_f_shift_gw_31_1 [get_bd_ports lqg_f_shift_gw_31] [get_bd_pins lqg_axi_test_1/lqg_f_shift_gw_31]
connect_bd_net -net lqg_f_shift_gw_32_1 [get_bd_ports lqg_f_shift_gw_32] [get_bd_pins lqg_axi_test_1/lqg_f_shift_gw_32]
connect_bd_net -net lqg_f_shift_gw_33_1 [get_bd_ports lqg_f_shift_gw_33] [get_bd_pins lqg_axi_test_1/lqg_f_shift_gw_33]
connect_bd_net -net lqg_f_shift_gw_34_1 [get_bd_ports lqg_f_shift_gw_34] [get_bd_pins lqg_axi_test_1/lqg_f_shift_gw_34]
connect_bd_net -net lqg_f_shift_gw_35_1 [get_bd_ports lqg_f_shift_gw_35] [get_bd_pins lqg_axi_test_1/lqg_f_shift_gw_35]
connect_bd_net -net lqg_f_shift_gw_36_1 [get_bd_ports lqg_f_shift_gw_36] [get_bd_pins lqg_axi_test_1/lqg_f_shift_gw_36]
connect_bd_net -net lqg_f_shift_gw_37_1 [get_bd_ports lqg_f_shift_gw_37] [get_bd_pins lqg_axi_test_1/lqg_f_shift_gw_37]
connect_bd_net -net lqg_f_shift_gw_38_1 [get_bd_ports lqg_f_shift_gw_38] [get_bd_pins lqg_axi_test_1/lqg_f_shift_gw_38]
connect_bd_net -net lqg_f_shift_gw_39_1 [get_bd_ports lqg_f_shift_gw_39] [get_bd_pins lqg_axi_test_1/lqg_f_shift_gw_39]
connect_bd_net -net lqg_f_shift_gw_3_1 [get_bd_ports lqg_f_shift_gw_3] [get_bd_pins lqg_axi_test_1/lqg_f_shift_gw_3]
connect_bd_net -net lqg_f_shift_gw_40_1 [get_bd_ports lqg_f_shift_gw_40] [get_bd_pins lqg_axi_test_1/lqg_f_shift_gw_40]
connect_bd_net -net lqg_f_shift_gw_41_1 [get_bd_ports lqg_f_shift_gw_41] [get_bd_pins lqg_axi_test_1/lqg_f_shift_gw_41]
connect_bd_net -net lqg_f_shift_gw_42_1 [get_bd_ports lqg_f_shift_gw_42] [get_bd_pins lqg_axi_test_1/lqg_f_shift_gw_42]
connect_bd_net -net lqg_f_shift_gw_43_1 [get_bd_ports lqg_f_shift_gw_43] [get_bd_pins lqg_axi_test_1/lqg_f_shift_gw_43]
connect_bd_net -net lqg_f_shift_gw_44_1 [get_bd_ports lqg_f_shift_gw_44] [get_bd_pins lqg_axi_test_1/lqg_f_shift_gw_44]
connect_bd_net -net lqg_f_shift_gw_45_1 [get_bd_ports lqg_f_shift_gw_45] [get_bd_pins lqg_axi_test_1/lqg_f_shift_gw_45]
connect_bd_net -net lqg_f_shift_gw_46_1 [get_bd_ports lqg_f_shift_gw_46] [get_bd_pins lqg_axi_test_1/lqg_f_shift_gw_46]
connect_bd_net -net lqg_f_shift_gw_47_1 [get_bd_ports lqg_f_shift_gw_47] [get_bd_pins lqg_axi_test_1/lqg_f_shift_gw_47]
connect_bd_net -net lqg_f_shift_gw_48_1 [get_bd_ports lqg_f_shift_gw_48] [get_bd_pins lqg_axi_test_1/lqg_f_shift_gw_48]
connect_bd_net -net lqg_f_shift_gw_4_1 [get_bd_ports lqg_f_shift_gw_4] [get_bd_pins lqg_axi_test_1/lqg_f_shift_gw_4]
connect_bd_net -net lqg_f_shift_gw_5_1 [get_bd_ports lqg_f_shift_gw_5] [get_bd_pins lqg_axi_test_1/lqg_f_shift_gw_5]
connect_bd_net -net lqg_f_shift_gw_6_1 [get_bd_ports lqg_f_shift_gw_6] [get_bd_pins lqg_axi_test_1/lqg_f_shift_gw_6]
connect_bd_net -net lqg_f_shift_gw_7_1 [get_bd_ports lqg_f_shift_gw_7] [get_bd_pins lqg_axi_test_1/lqg_f_shift_gw_7]
connect_bd_net -net lqg_f_shift_gw_8_1 [get_bd_ports lqg_f_shift_gw_8] [get_bd_pins lqg_axi_test_1/lqg_f_shift_gw_8]
connect_bd_net -net lqg_f_shift_gw_9_1 [get_bd_ports lqg_f_shift_gw_9] [get_bd_pins lqg_axi_test_1/lqg_f_shift_gw_9]
connect_bd_net -net lqg_gamma_res_gw_0_1 [get_bd_ports lqg_gamma_res_gw_0] [get_bd_pins lqg_axi_test_1/lqg_gamma_res_gw_0]
connect_bd_net -net lqg_gamma_res_gw_10_1 [get_bd_ports lqg_gamma_res_gw_10] [get_bd_pins lqg_axi_test_1/lqg_gamma_res_gw_10]
connect_bd_net -net lqg_gamma_res_gw_11_1 [get_bd_ports lqg_gamma_res_gw_11] [get_bd_pins lqg_axi_test_1/lqg_gamma_res_gw_11]
connect_bd_net -net lqg_gamma_res_gw_12_1 [get_bd_ports lqg_gamma_res_gw_12] [get_bd_pins lqg_axi_test_1/lqg_gamma_res_gw_12]
connect_bd_net -net lqg_gamma_res_gw_13_1 [get_bd_ports lqg_gamma_res_gw_13] [get_bd_pins lqg_axi_test_1/lqg_gamma_res_gw_13]
connect_bd_net -net lqg_gamma_res_gw_1_1 [get_bd_ports lqg_gamma_res_gw_1] [get_bd_pins lqg_axi_test_1/lqg_gamma_res_gw_1]
connect_bd_net -net lqg_gamma_res_gw_2_1 [get_bd_ports lqg_gamma_res_gw_2] [get_bd_pins lqg_axi_test_1/lqg_gamma_res_gw_2]
connect_bd_net -net lqg_gamma_res_gw_3_1 [get_bd_ports lqg_gamma_res_gw_3] [get_bd_pins lqg_axi_test_1/lqg_gamma_res_gw_3]
connect_bd_net -net lqg_gamma_res_gw_4_1 [get_bd_ports lqg_gamma_res_gw_4] [get_bd_pins lqg_axi_test_1/lqg_gamma_res_gw_4]
connect_bd_net -net lqg_gamma_res_gw_5_1 [get_bd_ports lqg_gamma_res_gw_5] [get_bd_pins lqg_axi_test_1/lqg_gamma_res_gw_5]
connect_bd_net -net lqg_gamma_res_gw_6_1 [get_bd_ports lqg_gamma_res_gw_6] [get_bd_pins lqg_axi_test_1/lqg_gamma_res_gw_6]
connect_bd_net -net lqg_gamma_res_gw_7_1 [get_bd_ports lqg_gamma_res_gw_7] [get_bd_pins lqg_axi_test_1/lqg_gamma_res_gw_7]
connect_bd_net -net lqg_gamma_res_gw_8_1 [get_bd_ports lqg_gamma_res_gw_8] [get_bd_pins lqg_axi_test_1/lqg_gamma_res_gw_8]
connect_bd_net -net lqg_gamma_res_gw_9_1 [get_bd_ports lqg_gamma_res_gw_9] [get_bd_pins lqg_axi_test_1/lqg_gamma_res_gw_9]
connect_bd_net -net lqg_gamma_shift_gw_0_1 [get_bd_ports lqg_gamma_shift_gw_0] [get_bd_pins lqg_axi_test_1/lqg_gamma_shift_gw_0]
connect_bd_net -net lqg_gamma_shift_gw_10_1 [get_bd_ports lqg_gamma_shift_gw_10] [get_bd_pins lqg_axi_test_1/lqg_gamma_shift_gw_10]
connect_bd_net -net lqg_gamma_shift_gw_11_1 [get_bd_ports lqg_gamma_shift_gw_11] [get_bd_pins lqg_axi_test_1/lqg_gamma_shift_gw_11]
connect_bd_net -net lqg_gamma_shift_gw_12_1 [get_bd_ports lqg_gamma_shift_gw_12] [get_bd_pins lqg_axi_test_1/lqg_gamma_shift_gw_12]
connect_bd_net -net lqg_gamma_shift_gw_13_1 [get_bd_ports lqg_gamma_shift_gw_13] [get_bd_pins lqg_axi_test_1/lqg_gamma_shift_gw_13]
connect_bd_net -net lqg_gamma_shift_gw_1_1 [get_bd_ports lqg_gamma_shift_gw_1] [get_bd_pins lqg_axi_test_1/lqg_gamma_shift_gw_1]
connect_bd_net -net lqg_gamma_shift_gw_2_1 [get_bd_ports lqg_gamma_shift_gw_2] [get_bd_pins lqg_axi_test_1/lqg_gamma_shift_gw_2]
connect_bd_net -net lqg_gamma_shift_gw_3_1 [get_bd_ports lqg_gamma_shift_gw_3] [get_bd_pins lqg_axi_test_1/lqg_gamma_shift_gw_3]
connect_bd_net -net lqg_gamma_shift_gw_4_1 [get_bd_ports lqg_gamma_shift_gw_4] [get_bd_pins lqg_axi_test_1/lqg_gamma_shift_gw_4]
connect_bd_net -net lqg_gamma_shift_gw_5_1 [get_bd_ports lqg_gamma_shift_gw_5] [get_bd_pins lqg_axi_test_1/lqg_gamma_shift_gw_5]
connect_bd_net -net lqg_gamma_shift_gw_6_1 [get_bd_ports lqg_gamma_shift_gw_6] [get_bd_pins lqg_axi_test_1/lqg_gamma_shift_gw_6]
connect_bd_net -net lqg_gamma_shift_gw_7_1 [get_bd_ports lqg_gamma_shift_gw_7] [get_bd_pins lqg_axi_test_1/lqg_gamma_shift_gw_7]
connect_bd_net -net lqg_gamma_shift_gw_8_1 [get_bd_ports lqg_gamma_shift_gw_8] [get_bd_pins lqg_axi_test_1/lqg_gamma_shift_gw_8]
connect_bd_net -net lqg_gamma_shift_gw_9_1 [get_bd_ports lqg_gamma_shift_gw_9] [get_bd_pins lqg_axi_test_1/lqg_gamma_shift_gw_9]
connect_bd_net -net lqg_k_res_gw_0_1 [get_bd_ports lqg_k_res_gw_0] [get_bd_pins lqg_axi_test_1/lqg_k_res_gw_0]
connect_bd_net -net lqg_k_res_gw_10_1 [get_bd_ports lqg_k_res_gw_10] [get_bd_pins lqg_axi_test_1/lqg_k_res_gw_10]
connect_bd_net -net lqg_k_res_gw_11_1 [get_bd_ports lqg_k_res_gw_11] [get_bd_pins lqg_axi_test_1/lqg_k_res_gw_11]
connect_bd_net -net lqg_k_res_gw_12_1 [get_bd_ports lqg_k_res_gw_12] [get_bd_pins lqg_axi_test_1/lqg_k_res_gw_12]
connect_bd_net -net lqg_k_res_gw_13_1 [get_bd_ports lqg_k_res_gw_13] [get_bd_pins lqg_axi_test_1/lqg_k_res_gw_13]
connect_bd_net -net lqg_k_res_gw_1_1 [get_bd_ports lqg_k_res_gw_1] [get_bd_pins lqg_axi_test_1/lqg_k_res_gw_1]
connect_bd_net -net lqg_k_res_gw_2_1 [get_bd_ports lqg_k_res_gw_2] [get_bd_pins lqg_axi_test_1/lqg_k_res_gw_2]
connect_bd_net -net lqg_k_res_gw_3_1 [get_bd_ports lqg_k_res_gw_3] [get_bd_pins lqg_axi_test_1/lqg_k_res_gw_3]
connect_bd_net -net lqg_k_res_gw_4_1 [get_bd_ports lqg_k_res_gw_4] [get_bd_pins lqg_axi_test_1/lqg_k_res_gw_4]
connect_bd_net -net lqg_k_res_gw_5_1 [get_bd_ports lqg_k_res_gw_5] [get_bd_pins lqg_axi_test_1/lqg_k_res_gw_5]
connect_bd_net -net lqg_k_res_gw_6_1 [get_bd_ports lqg_k_res_gw_6] [get_bd_pins lqg_axi_test_1/lqg_k_res_gw_6]
connect_bd_net -net lqg_k_res_gw_7_1 [get_bd_ports lqg_k_res_gw_7] [get_bd_pins lqg_axi_test_1/lqg_k_res_gw_7]
connect_bd_net -net lqg_k_res_gw_8_1 [get_bd_ports lqg_k_res_gw_8] [get_bd_pins lqg_axi_test_1/lqg_k_res_gw_8]
connect_bd_net -net lqg_k_res_gw_9_1 [get_bd_ports lqg_k_res_gw_9] [get_bd_pins lqg_axi_test_1/lqg_k_res_gw_9]
connect_bd_net -net lqg_k_shift_gw_0_1 [get_bd_ports lqg_k_shift_gw_0] [get_bd_pins lqg_axi_test_1/lqg_k_shift_gw_0]
connect_bd_net -net lqg_k_shift_gw_10_1 [get_bd_ports lqg_k_shift_gw_10] [get_bd_pins lqg_axi_test_1/lqg_k_shift_gw_10]
connect_bd_net -net lqg_k_shift_gw_11_1 [get_bd_ports lqg_k_shift_gw_11] [get_bd_pins lqg_axi_test_1/lqg_k_shift_gw_11]
connect_bd_net -net lqg_k_shift_gw_12_1 [get_bd_ports lqg_k_shift_gw_12] [get_bd_pins lqg_axi_test_1/lqg_k_shift_gw_12]
connect_bd_net -net lqg_k_shift_gw_13_1 [get_bd_ports lqg_k_shift_gw_13] [get_bd_pins lqg_axi_test_1/lqg_k_shift_gw_13]
connect_bd_net -net lqg_k_shift_gw_1_1 [get_bd_ports lqg_k_shift_gw_1] [get_bd_pins lqg_axi_test_1/lqg_k_shift_gw_1]
connect_bd_net -net lqg_k_shift_gw_2_1 [get_bd_ports lqg_k_shift_gw_2] [get_bd_pins lqg_axi_test_1/lqg_k_shift_gw_2]
connect_bd_net -net lqg_k_shift_gw_3_1 [get_bd_ports lqg_k_shift_gw_3] [get_bd_pins lqg_axi_test_1/lqg_k_shift_gw_3]
connect_bd_net -net lqg_k_shift_gw_4_1 [get_bd_ports lqg_k_shift_gw_4] [get_bd_pins lqg_axi_test_1/lqg_k_shift_gw_4]
connect_bd_net -net lqg_k_shift_gw_5_1 [get_bd_ports lqg_k_shift_gw_5] [get_bd_pins lqg_axi_test_1/lqg_k_shift_gw_5]
connect_bd_net -net lqg_k_shift_gw_6_1 [get_bd_ports lqg_k_shift_gw_6] [get_bd_pins lqg_axi_test_1/lqg_k_shift_gw_6]
connect_bd_net -net lqg_k_shift_gw_7_1 [get_bd_ports lqg_k_shift_gw_7] [get_bd_pins lqg_axi_test_1/lqg_k_shift_gw_7]
connect_bd_net -net lqg_k_shift_gw_8_1 [get_bd_ports lqg_k_shift_gw_8] [get_bd_pins lqg_axi_test_1/lqg_k_shift_gw_8]
connect_bd_net -net lqg_k_shift_gw_9_1 [get_bd_ports lqg_k_shift_gw_9] [get_bd_pins lqg_axi_test_1/lqg_k_shift_gw_9]
connect_bd_net -net lqg_l_res_gw_0_1 [get_bd_ports lqg_l_res_gw_0] [get_bd_pins lqg_axi_test_1/lqg_l_res_gw_0]
connect_bd_net -net lqg_l_res_gw_10_1 [get_bd_ports lqg_l_res_gw_10] [get_bd_pins lqg_axi_test_1/lqg_l_res_gw_10]
connect_bd_net -net lqg_l_res_gw_11_1 [get_bd_ports lqg_l_res_gw_11] [get_bd_pins lqg_axi_test_1/lqg_l_res_gw_11]
connect_bd_net -net lqg_l_res_gw_12_1 [get_bd_ports lqg_l_res_gw_12] [get_bd_pins lqg_axi_test_1/lqg_l_res_gw_12]
connect_bd_net -net lqg_l_res_gw_13_1 [get_bd_ports lqg_l_res_gw_13] [get_bd_pins lqg_axi_test_1/lqg_l_res_gw_13]
connect_bd_net -net lqg_l_res_gw_1_1 [get_bd_ports lqg_l_res_gw_1] [get_bd_pins lqg_axi_test_1/lqg_l_res_gw_1]
connect_bd_net -net lqg_l_res_gw_2_1 [get_bd_ports lqg_l_res_gw_2] [get_bd_pins lqg_axi_test_1/lqg_l_res_gw_2]
connect_bd_net -net lqg_l_res_gw_3_1 [get_bd_ports lqg_l_res_gw_3] [get_bd_pins lqg_axi_test_1/lqg_l_res_gw_3]
connect_bd_net -net lqg_l_res_gw_4_1 [get_bd_ports lqg_l_res_gw_4] [get_bd_pins lqg_axi_test_1/lqg_l_res_gw_4]
connect_bd_net -net lqg_l_res_gw_5_1 [get_bd_ports lqg_l_res_gw_5] [get_bd_pins lqg_axi_test_1/lqg_l_res_gw_5]
connect_bd_net -net lqg_l_res_gw_6_1 [get_bd_ports lqg_l_res_gw_6] [get_bd_pins lqg_axi_test_1/lqg_l_res_gw_6]
connect_bd_net -net lqg_l_res_gw_7_1 [get_bd_ports lqg_l_res_gw_7] [get_bd_pins lqg_axi_test_1/lqg_l_res_gw_7]
connect_bd_net -net lqg_l_res_gw_8_1 [get_bd_ports lqg_l_res_gw_8] [get_bd_pins lqg_axi_test_1/lqg_l_res_gw_8]
connect_bd_net -net lqg_l_res_gw_9_1 [get_bd_ports lqg_l_res_gw_9] [get_bd_pins lqg_axi_test_1/lqg_l_res_gw_9]
connect_bd_net -net lqg_l_shift_gw_0_1 [get_bd_ports lqg_l_shift_gw_0] [get_bd_pins lqg_axi_test_1/lqg_l_shift_gw_0]
connect_bd_net -net lqg_l_shift_gw_10_1 [get_bd_ports lqg_l_shift_gw_10] [get_bd_pins lqg_axi_test_1/lqg_l_shift_gw_10]
connect_bd_net -net lqg_l_shift_gw_11_1 [get_bd_ports lqg_l_shift_gw_11] [get_bd_pins lqg_axi_test_1/lqg_l_shift_gw_11]
connect_bd_net -net lqg_l_shift_gw_12_1 [get_bd_ports lqg_l_shift_gw_12] [get_bd_pins lqg_axi_test_1/lqg_l_shift_gw_12]
connect_bd_net -net lqg_l_shift_gw_13_1 [get_bd_ports lqg_l_shift_gw_13] [get_bd_pins lqg_axi_test_1/lqg_l_shift_gw_13]
connect_bd_net -net lqg_l_shift_gw_1_1 [get_bd_ports lqg_l_shift_gw_1] [get_bd_pins lqg_axi_test_1/lqg_l_shift_gw_1]
connect_bd_net -net lqg_l_shift_gw_2_1 [get_bd_ports lqg_l_shift_gw_2] [get_bd_pins lqg_axi_test_1/lqg_l_shift_gw_2]
connect_bd_net -net lqg_l_shift_gw_3_1 [get_bd_ports lqg_l_shift_gw_3] [get_bd_pins lqg_axi_test_1/lqg_l_shift_gw_3]
connect_bd_net -net lqg_l_shift_gw_4_1 [get_bd_ports lqg_l_shift_gw_4] [get_bd_pins lqg_axi_test_1/lqg_l_shift_gw_4]
connect_bd_net -net lqg_l_shift_gw_5_1 [get_bd_ports lqg_l_shift_gw_5] [get_bd_pins lqg_axi_test_1/lqg_l_shift_gw_5]
connect_bd_net -net lqg_l_shift_gw_6_1 [get_bd_ports lqg_l_shift_gw_6] [get_bd_pins lqg_axi_test_1/lqg_l_shift_gw_6]
connect_bd_net -net lqg_l_shift_gw_7_1 [get_bd_ports lqg_l_shift_gw_7] [get_bd_pins lqg_axi_test_1/lqg_l_shift_gw_7]
connect_bd_net -net lqg_l_shift_gw_8_1 [get_bd_ports lqg_l_shift_gw_8] [get_bd_pins lqg_axi_test_1/lqg_l_shift_gw_8]
connect_bd_net -net lqg_l_shift_gw_9_1 [get_bd_ports lqg_l_shift_gw_9] [get_bd_pins lqg_axi_test_1/lqg_l_shift_gw_9]
connect_bd_net [get_bd_ports lqg_led_in] [get_bd_pins lqg_axi_test_1/lqg_led_in]
connect_bd_net [get_bd_ports proc_sys_clk] [get_bd_pins lqg_axi_test_1/proc_sys_clk]
connect_bd_net [get_bd_pins processing_system_1/FCLK_CLK0] \
  [get_bd_pins processing_system_1/M_AXI_GP0_ACLK] [get_bd_pins processing_system_1_axi_periph/S00_ACLK] \
  [get_bd_pins rst_processing_system_1_50M/slowest_sync_clk] [get_bd_pins lqg_axi_test_1/axi_sys_clk] \
  [get_bd_pins processing_system_1_axi_periph/M00_ACLK] [get_bd_pins processing_system_1_axi_periph/ACLK]
connect_bd_net [get_bd_pins processing_system_1/FCLK_RESET0_N] [get_bd_pins rst_processing_system_1_50M/ext_reset_in]
connect_bd_net [get_bd_pins rst_processing_system_1_50M/peripheral_aresetn] \
  [get_bd_pins processing_system_1_axi_periph/S00_ARESETN] [get_bd_pins lqg_axi_test_1/axi_sys_aresetn] \
  [get_bd_pins processing_system_1_axi_periph/M00_ARESETN] [get_bd_pins processing_system_1_axi_periph/ARESETN]
connect_bd_net -net uk_factor_gw_0_1 [get_bd_ports uk_factor_gw_0] [get_bd_pins lqg_axi_test_1/uk_factor_gw_0]
connect_bd_net -net uk_factor_gw_1_1 [get_bd_ports uk_factor_gw_1] [get_bd_pins lqg_axi_test_1/uk_factor_gw_1]
connect_bd_net -net uk_offset_gw_0_1 [get_bd_ports uk_offset_gw_0] [get_bd_pins lqg_axi_test_1/uk_offset_gw_0]
connect_bd_net -net uk_offset_gw_1_1 [get_bd_ports uk_offset_gw_1] [get_bd_pins lqg_axi_test_1/uk_offset_gw_1]
connect_bd_net -net yk_factor_gw_0_1 [get_bd_ports yk_factor_gw_0] [get_bd_pins lqg_axi_test_1/yk_factor_gw_0]
connect_bd_net -net yk_factor_gw_1_1 [get_bd_ports yk_factor_gw_1] [get_bd_pins lqg_axi_test_1/yk_factor_gw_1]
connect_bd_net -net yk_gw_0_1 [get_bd_ports yk_gw_0] [get_bd_pins lqg_axi_test_1/yk_gw_0]
connect_bd_net -net yk_gw_1_1 [get_bd_ports yk_gw_1] [get_bd_pins lqg_axi_test_1/yk_gw_1]
connect_bd_net -net yk_offset_gw_0_1 [get_bd_ports yk_offset_gw_0] [get_bd_pins lqg_axi_test_1/yk_offset_gw_0]
connect_bd_net -net yk_offset_gw_1_1 [get_bd_ports yk_offset_gw_1] [get_bd_pins lqg_axi_test_1/yk_offset_gw_1]

# ---- address map ----
assign_bd_address -offset 0x40000000 -range 4K -target_address_space [get_bd_addr_spaces processing_system_1/Data] [get_bd_addr_segs lqg_axi_test_1/axi_sys_s_axi/reg0]

validate_bd_design
save_bd_design
